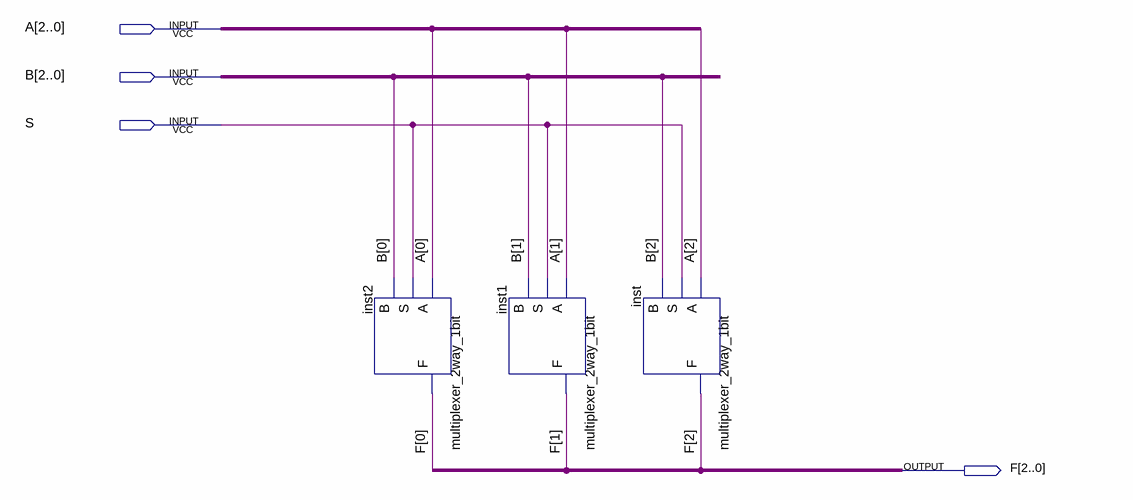
[diagram p0: schematic sheet]
// Quartus schematic multiplexer_2way_3bit.bdf as structural Verilog: 3 symbols, 4 pins
module multiplexer_2way_3bit (
  input  [2:0] A,
  input  [2:0] B,
  input  S,
  output [2:0] F
);

  multiplexer_2way_1bit inst2 (.A(A[0]), .S(S), .B(B[0]), .F(F[0]));
  multiplexer_2way_1bit inst1 (.A(A[1]), .S(S), .B(B[1]), .F(F[1]));
  multiplexer_2way_1bit inst (.A(A[2]), .S(S), .B(B[2]), .F(F[2]));
endmodule
